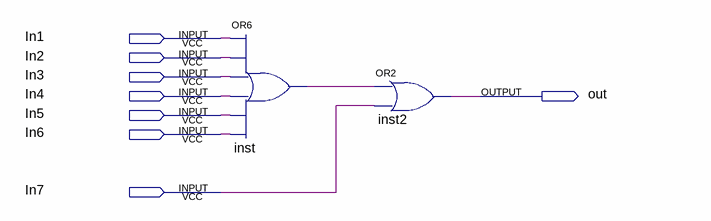
[diagram p0: schematic sheet]
// Quartus schematic or7.bdf as structural Verilog: 2 symbols, 8 pins
module or7 (
  input  In1,
  input  In2,
  input  In3,
  input  In4,
  input  In5,
  input  In6,
  input  In7,
  output out
);

  wire inst_out;

  or inst (inst_out, In1, In2, In3, In4, In5, In6);
  or inst2 (out, inst_out, In7);
endmodule
